# EAGLE design cpm_mikrobus (EAGLE 6.4)
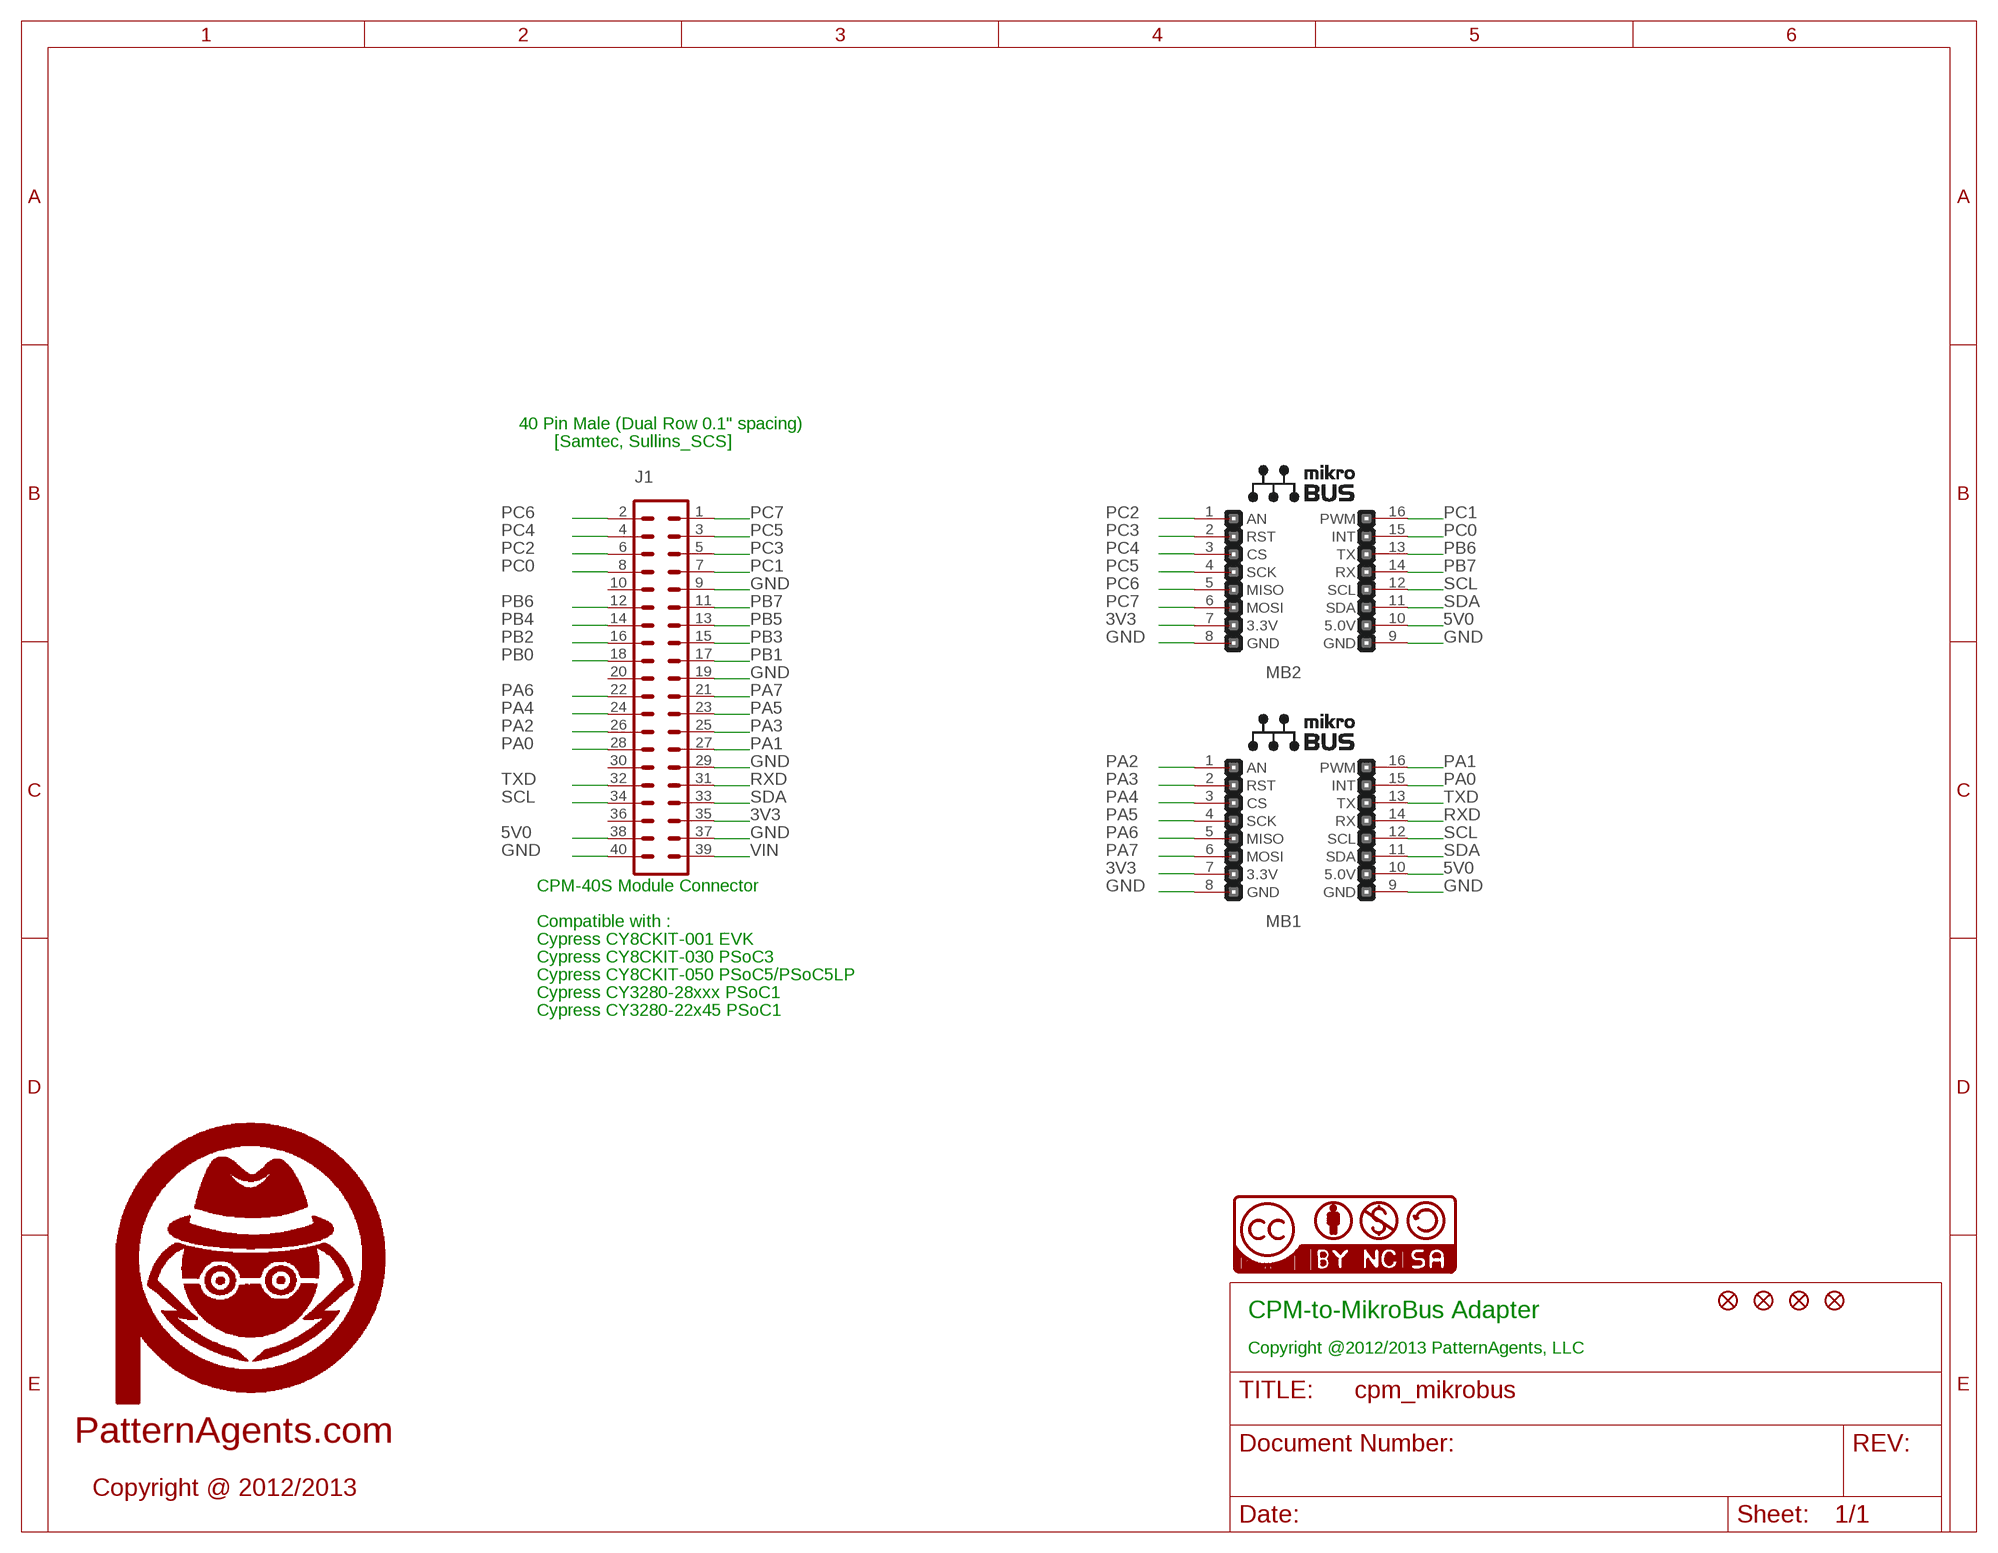
[diagram p0: schematic, sheet 1]

## Parts
J1  SULLINS_SCS  MA20-2  [MA20-2]
JP1  FIDUCIAL1.5X3  [FIDUCIAL-1.5X3]
JP2  FIDUCIAL1.5X3  [FIDUCIAL-1.5X3]
JP3  FIDUCIAL1.5X3  [FIDUCIAL-1.5X3]
JP4  FIDUCIAL1.5X3  [FIDUCIAL-1.5X3]
MB1  MIKROBUS_SOCKET  [MIKROBUS_SOCKET]
MB2  MIKROBUS_SOCKET  [MIKROBUS_SOCKET]
U$1  LOGO_PA_AGENTLARGE  [LOGO_PA_AGENT_LARGE]
U$2  BY_CC_SA_SYMNULL  [NULL_SYM]

## Nets
3V3: J1.35 MB1.7(3.3V) MB2.7(3.3V)
5V0: J1.38 MB1.10(5.0V) MB2.10(5.0V)
GND: J1.9 J1.19 J1.29 J1.37 J1.40 MB1.8(GND) MB1.9(GND) MB2.8(GND) MB2.9(GND)
PA0: J1.28 MB1.15(INT)
PA1: J1.27 MB1.16(PWM)
PA2: J1.26 MB1.1(AN)
PA3: J1.25 MB1.2(RST)
PA4: J1.24 MB1.3(CS)
PA5: J1.23 MB1.4(SCK)
PA6: J1.22 MB1.5(MISO)
PA7: J1.21 MB1.6(MOSI)
PB0: J1.18
PB1: J1.17
PB2: J1.16
PB3: J1.15
PB4: J1.14
PB5: J1.13
PB6: J1.12 MB2.13(TX)
PB7: J1.11 MB2.14(RX)
PC0: J1.8 MB2.15(INT)
PC1: J1.7 MB2.16(PWM)
PC2: J1.6 MB2.1(AN)
PC3: J1.5 MB2.2(RST)
PC4: J1.4 MB2.3(CS)
PC5: J1.3 MB2.4(SCK)
PC6: J1.2 MB2.5(MISO)
PC7: J1.1 MB2.6(MOSI)
RXD: J1.31 MB1.14(RX)
SCL: J1.34 MB1.12(SCL) MB2.12(SCL)
SDA: J1.33 MB1.11(SDA) MB2.11(SDA)
TXD: J1.32 MB1.13(TX)
VIN: J1.39
Unconnected: J1.10 J1.20 J1.30 J1.36

## Notes on the sheet
- 40 Pin Male (Dual Row 0.1" spacing)
- [Samtec, Sullins_SCS]
- CPM-40S Module Connector
- Compatible with :
- Cypress CY8CKIT-001 EVK
- Cypress CY8CKIT-030 PSoC3
- Cypress CY8CKIT-050 PSoC5/PSoC5LP
- Cypress CY3280-28xxx PSoC1
- Cypress CY3280-22x45 PSoC1
- CPM-to-MikroBus Adapter
- Copyright @2012/2013 PatternAgents, LLC
- PatternAgents.com
- Copyright @ 2012/2013

## Library data of the parts
J1 = moxdes_V1_0:MA20-2: 40 PIN HEADER; MF: Sullins; MPN: PBC20DBAN; OC_FARNELL: unknown; OC_NEWARK: unknown
JP1-JP4 = PatternAgents-Misc:FIDUCIAL: Fiducial Alignment Points Various fiducial points for machine vision alignment.
MB1 MB2 = moxdes_V1_0:MIKROBUS_SOCKET
U$1 = PatternAgents-Aesthetics:LOGO_PA_AGENT: PatternAgents Logo Copyright @2012/2013 PatternAgents.com
U$2 = PatternAgents-Logos:BY_CC_SA_SYM: BY_CC_SA Source : http://wiki.creativecommons.org/CC_markers Github : https://github.com/PatternAgents/PCB_Libraries License : http://creativecommons.org/licenses/by-sa/3.0/ (Creative Commons 3.0) THIS SOFTWARE IS PROVIDED BY THE CONTRIBUTORS "AS IS" AND WITHOUT ANY EXPRESS OR IMPLIED WARRANTIES, INCLUDING, BUT NOT LIMITED TO, THE IMPLIED WARRANTIES OF MERCHANTABILITY AND FITNESS FOR A PARTICULAR PURPOSE ARE DISCLAIMED. IN NO EVENT SHALL THE COPYRIGHT OWNER OR CONTRIBUTORS BE LIABLE FOR ANY DIRECT, INDIRECT, INCIDENTAL, SPECIAL, EXEMPLARY, OR CONSEQUENTIAL DAMAGES (INCLUDING, BUT NOT LIMITED TO, PROCUREMENT OF SUBSTITUTE GOODS OR SERVICES; LOSS OF USE, DATA, OR PROFITS; OR BUSINESS INTERRUPTION) HOWEVER CAUSED AND ON ANY THEORY OF LIABILITY, WHETHER IN CONTRACT, STRICT LIABILITY, OR TORT (INCLUDING NEGLIGENCE OR OTHERWISE) ARISING IN ANY WAY OUT OF THE USE OF THIS SOFTWARE, EVEN IF ADVISED OF THE POSSIBILITY OF SUCH DAMAGE.

## Board
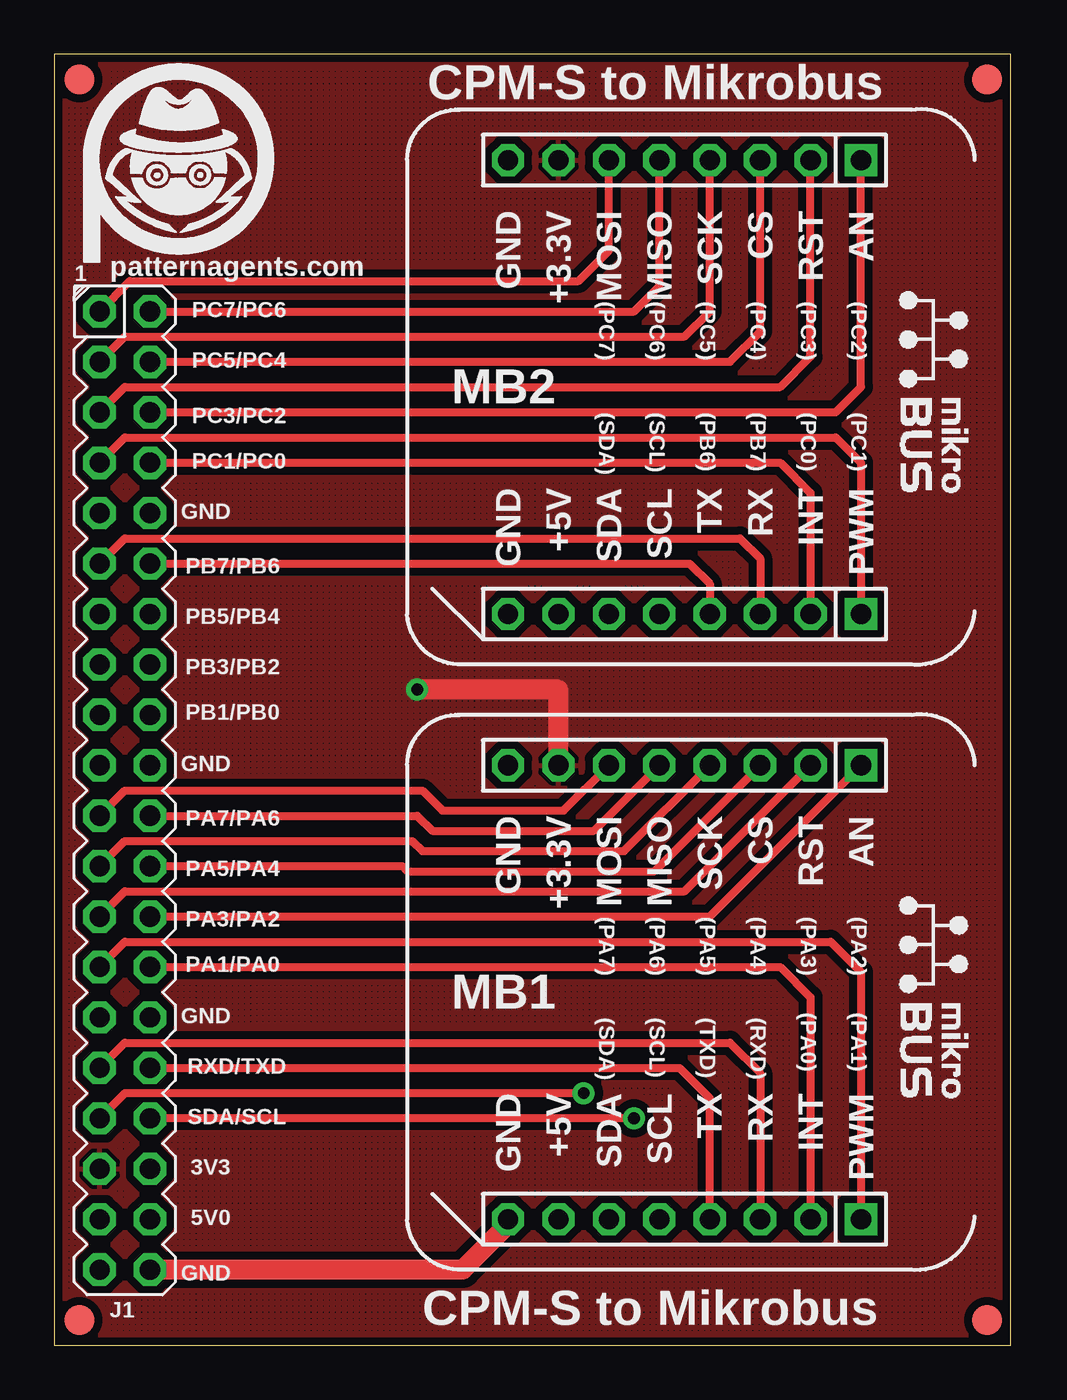
[diagram p1: board, top side]
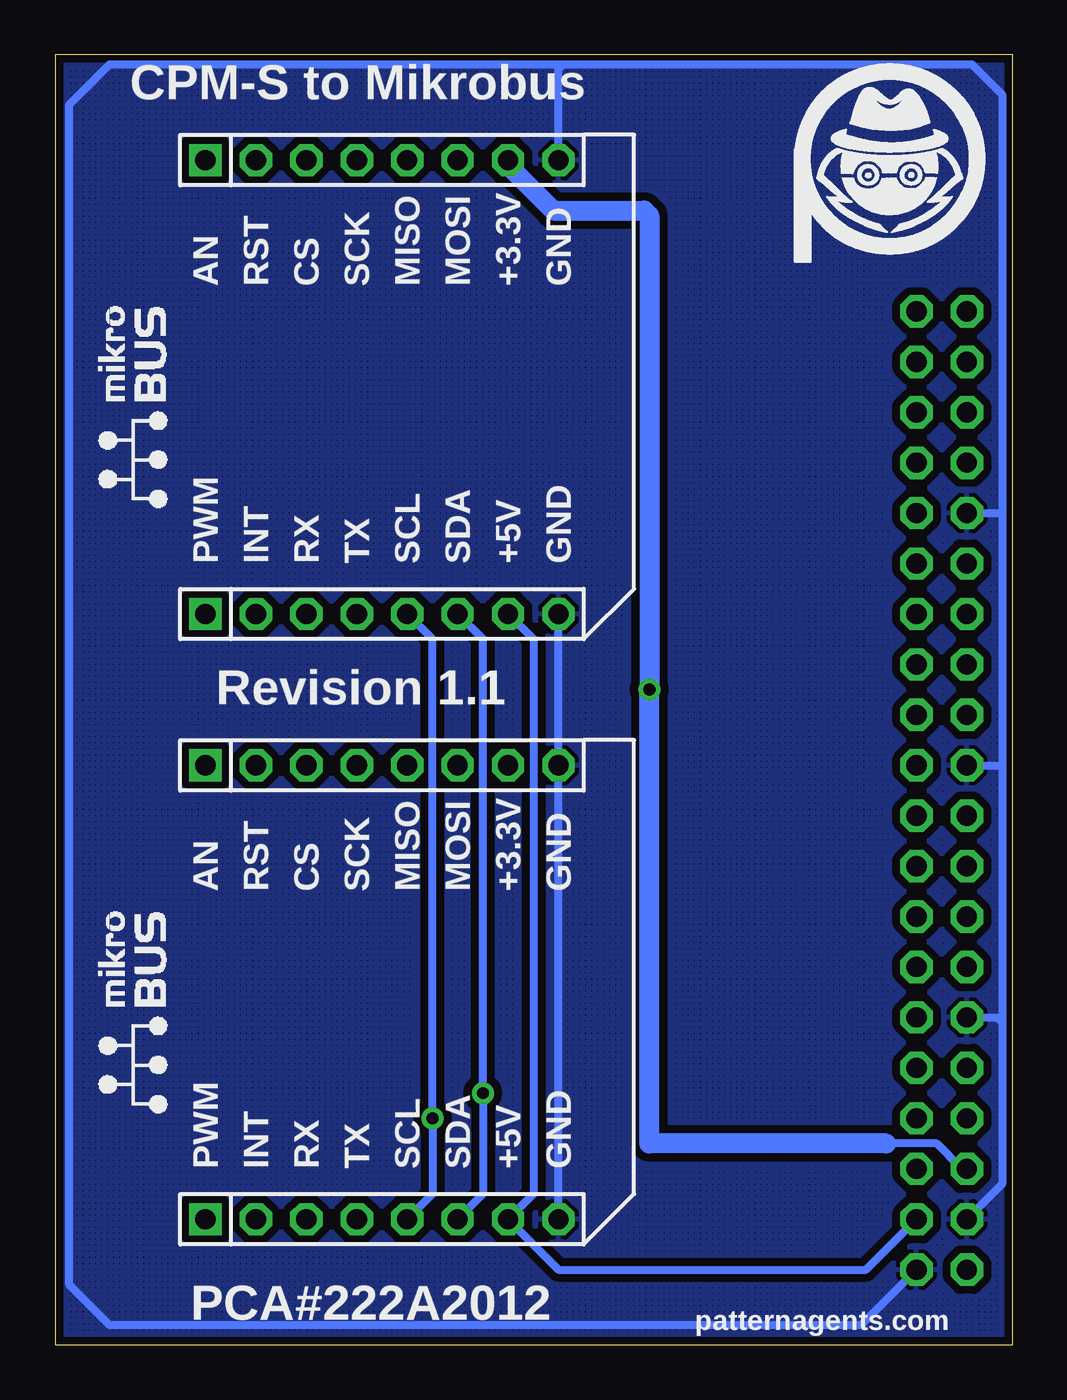
[diagram p2: board, bottom side, seen from below]

Size 48.18 x 65.01 mm. Coordinates in mm from the lower left corner, seen from the top.
Outline: 0,0 48.18,0 48.18,65.01 0,65.01 0,0
Copper layers (1*16): Top 0.035mm / dielectric 1.5mm / Bottom 0.035mm
Design rules "PatternAgents": minimum track width 8mil, minimum drill 14mil, track to track 8mil, track to pad 8mil, pad to pad 8mil, via to via 8mil, smd to smd 8mil, copper to edge 10mil, drill to drill 8mil, minimum pad ring 12mil, minimum via ring 10mil, stop-mask expansion 4mil, vias tented up to drill 25mil, thermal gap 8mil

### Footprints (pad centres in the part's own frame; a part is rotated, then mirrored left to right if it is on the bottom)
MA20-2 = drill 1.016 octagon: 1 -24.13,-1.27; 2 -24.13,1.27; 3 -21.59,-1.27; 4 -21.59,1.27; 5 -19.05,-1.27; 6 -19.05,1.27; 7 -16.51,-1.27; 8 -16.51,1.27; 9 -13.97,-1.27; 10 -13.97,1.27; 11 -11.43,-1.27; 12 -11.43,1.27; 13 -8.89,-1.27; 14 -8.89,1.27; 15 -6.35,-1.27; 16 -6.35,1.27; 17 -3.81,-1.27; 18 -3.81,1.27; 19 -1.27,-1.27; 20 -1.27,1.27; 21 1.27,-1.27; 22 1.27,1.27; 23 3.81,-1.27; 24 3.81,1.27; 25 6.35,-1.27; 26 6.35,1.27; 27 8.89,-1.27; 28 8.89,1.27; 29 11.43,-1.27; 30 11.43,1.27; 31 13.97,-1.27; 32 13.97,1.27; 33 16.51,-1.27; 34 16.51,1.27; 35 19.05,-1.27; 36 19.05,1.27; 37 21.59,-1.27; 38 21.59,1.27; 39 24.13,-1.27; 40 24.13,1.27
FIDUCIAL-1.5X3 = smd 1.5 x 1.5: 1 0,0
MIKROBUS_SOCKET = drill 1.016 square: 1 -11.43,8.89; 16 11.43,8.89 | drill 1.016 octagon: 2 -11.43,6.35; 3 -11.43,3.81; 4 -11.43,1.27; 5 -11.43,-1.27; 6 -11.43,-3.81; 7 -11.43,-6.35; 8 -11.43,-8.89; 9 11.43,-8.89; 10 11.43,-6.35; 11 11.43,-3.81; 12 11.43,-1.27; 13 11.43,1.27; 14 11.43,3.81; 15 11.43,6.35

### Placement (x,y rotation side)
J1  3.56,27.94 270 top
JP1  1.27,63.75 0 top
JP2  1.27,1.27 0 top
JP3  46.99,1.27 0 top
JP4  46.99,63.75 0 top
MB1  31.75,17.78 270 top
MB2  31.75,48.26 270 top
U$1  6.1,58.93 0 bottom
U$2  -0.25,-0.51 0 top
U$3  LOGO_PA_AGENTLARGE  [LOGO_PA_AGENT_LARGE]  6.35,58.93 0 top

### Tracks (layer width: path | path; a pad name or v marks a point on that pad's centre or on a via)
3V3  (via drill 0.6)
  Top 1.016: MB1.7 25.4,33.02 v18.29,33.02
  Bottom 0.406: J1.35 2.54,8.89 3.81,10.16 6.35,10.16
  Bottom 1.016: MB2.7 25.4,59.44 23.11,57.15 18.54,57.15 18.29,56.9 v18.29,33.02 18.29,10.16 6.35,10.16
  pour Top (isolate 0.406, hatched): 0,65.02 48.26,65.02 48.26,0 0,0
5V0
  Bottom 0.406: MB2.10 24.13,35.56 24.13,7.62 MB1.10 22.86,3.81 7.37,3.81 J1.38
GND
  Top 1.016: J1.40 20.57,3.81 22.86,6.1 MB1.9
  Bottom 0.406: J1.40 7.62,1.02 45.47,1.02 47.5,3.05 47.5,62.48 45.47,64.52 22.61,64.52 | 22.61,64.52 2.03,64.52 0.51,62.99 0.51,41.91 | 0.51,41.91 0.51,29.21 | 0.51,29.21 0.51,16.26 | 0.51,16.26 0.51,8.13 J1.37 | MB1.9 MB1.8 MB2.9 | J1.19 0.51,29.21 | J1.29 0.76,16.51 0.51,16.26 | J1.9 0.51,41.91 | MB2.8 22.86,64.26 22.61,64.52
  pour Bottom (isolate 0.406, hatched): 0,65.02 48.26,65.02 48.26,0 0,0
PA0
  Top 0.406: J1.28 36.58,19.05 38.1,17.53 MB1.15
PA1
  Top 0.406: J1.27 3.56,20.32 39.12,20.32 40.64,18.8 MB1.16
PA2
  Top 0.406: J1.26 33.02,21.59 MB1.1
PA3
  Top 0.406: J1.25 3.56,22.86 31.75,22.86 MB1.2
PA4
  Top 0.406: J1.24 17.53,24.13 17.78,23.88 30.23,23.88 MB1.3
PA5
  Top 0.406: J1.23 3.56,25.4 18.03,25.4 18.54,24.89 28.7,24.89 MB1.4
PA6
  Top 0.406: J1.22 18.29,26.67 19.05,25.91 27.18,25.91 MB1.5
PA7
  Top 0.406: J1.21 3.56,27.94 18.54,27.94 19.56,26.92 25.65,26.92 MB1.6
PB6
  Top 0.406: J1.12 32,39.37 33.02,38.35 MB2.13
PB7
  Top 0.406: J1.11 3.56,40.64 34.54,40.64 35.56,39.62 MB2.14
PC0
  Top 0.406: J1.8 36.58,44.45 38.1,42.93 MB2.15
PC1
  Top 0.406: J1.7 3.56,45.72 39.37,45.72 40.64,44.45 MB2.16
PC2
  Top 0.406: J1.6 39.37,46.99 40.64,48.26 MB2.1
PC3
  Top 0.406: J1.5 3.56,48.26 36.58,48.26 38.1,49.78 MB2.2
PC4
  Top 0.406: J1.4 34.04,49.53 35.56,51.05 MB2.3
PC5
  Top 0.406: J1.3 3.56,50.8 31.75,50.8 33.02,52.07 MB2.4
PC6
  Top 0.406: J1.2 29.21,52.07 30.48,53.34 MB2.5
PC7
  Top 0.406: J1.1 3.81,53.59 26.42,53.59 27.94,55.12 MB2.6
RXD
  Top 0.406: J1.31 3.56,15.24 34.04,15.24 35.56,13.72 MB1.14
SCL  (via drill 0.6)
  Top 0.406: v29.21,11.43 J1.34
  Bottom 0.406: MB1.12 29.21,7.62 v29.21,11.43 29.21,35.56 MB2.12
SDA  (via drill 0.6)
  Top 0.406: v26.67,12.7 3.56,12.7 J1.33
  Bottom 0.406: MB1.11 26.67,7.62 v26.67,12.7 26.67,35.56 MB2.11
TXD
  Top 0.406: J1.32 31.5,13.97 33.02,12.45 MB1.13

### Text on the board
tPlace: CPM-S to Mikrobus | 1 | patternagents.com | PC7/PC6 | (PC7) | (PC6) | (PC5) | (PC4) | (PC3) | (PC2) | PC5/PC4 | PC3/PC2 | (SDA) | (SCL) | (PB6) | (PB7) | (PC0) | (PC1) | PC1/PC0 | GND | PB7/PB6 | PB5/PB4 | PB3/PB2 | PB1/PB0 | GND | PA7/PA6 | PA5/PA4 | (PA7) | (PA6) | (PA5) | (PA4) | (PA3) | (PA2) | PA3/PA2 | PA1/PA0 | GND | (SDA) | (SCL) | (TXD) | (RXD) | (PA0) | (PA1) | RXD/TXD | SDA/SCL | 3V3 | 5V0 | GND | CPM-S to Mikrobus
bPlace: CPM-S to Mikrobus | Revision 1.1 | patternagents.com | PCA#222A2012